# Altium schematic sheet Schema_Soldeerbout3.SchDoc
size A4; SheetNumber: 4; SheetTotal: 6
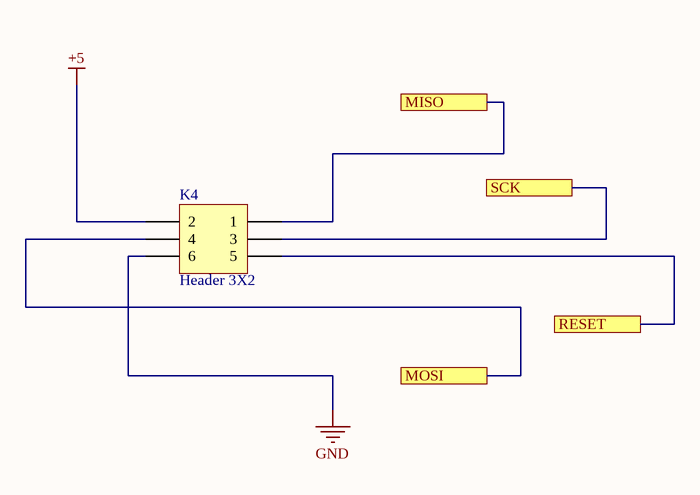
[diagram p0: Schema_Soldeerbout3.SchDoc]

## Parts
K4  Header 3X2  [HDR2X3]

## Ports
MISO, MOSI, RESET, SCK

## Nets
+5: K4.2
GND: K4.6
MISO: K4.1 ; port MISO
MOSI: K4.4 ; port MOSI
RESET: K4.5 ; port RESET
SCK: K4.3 ; port SCK

## Library data of the parts
K4 = Header 3X2: Header, 3-Pin, Dual row; LatestRevisionDate: 17-Jul-2002; LatestRevisionNote: Re-released for DXP Platform.; Publisher: Altium Limited